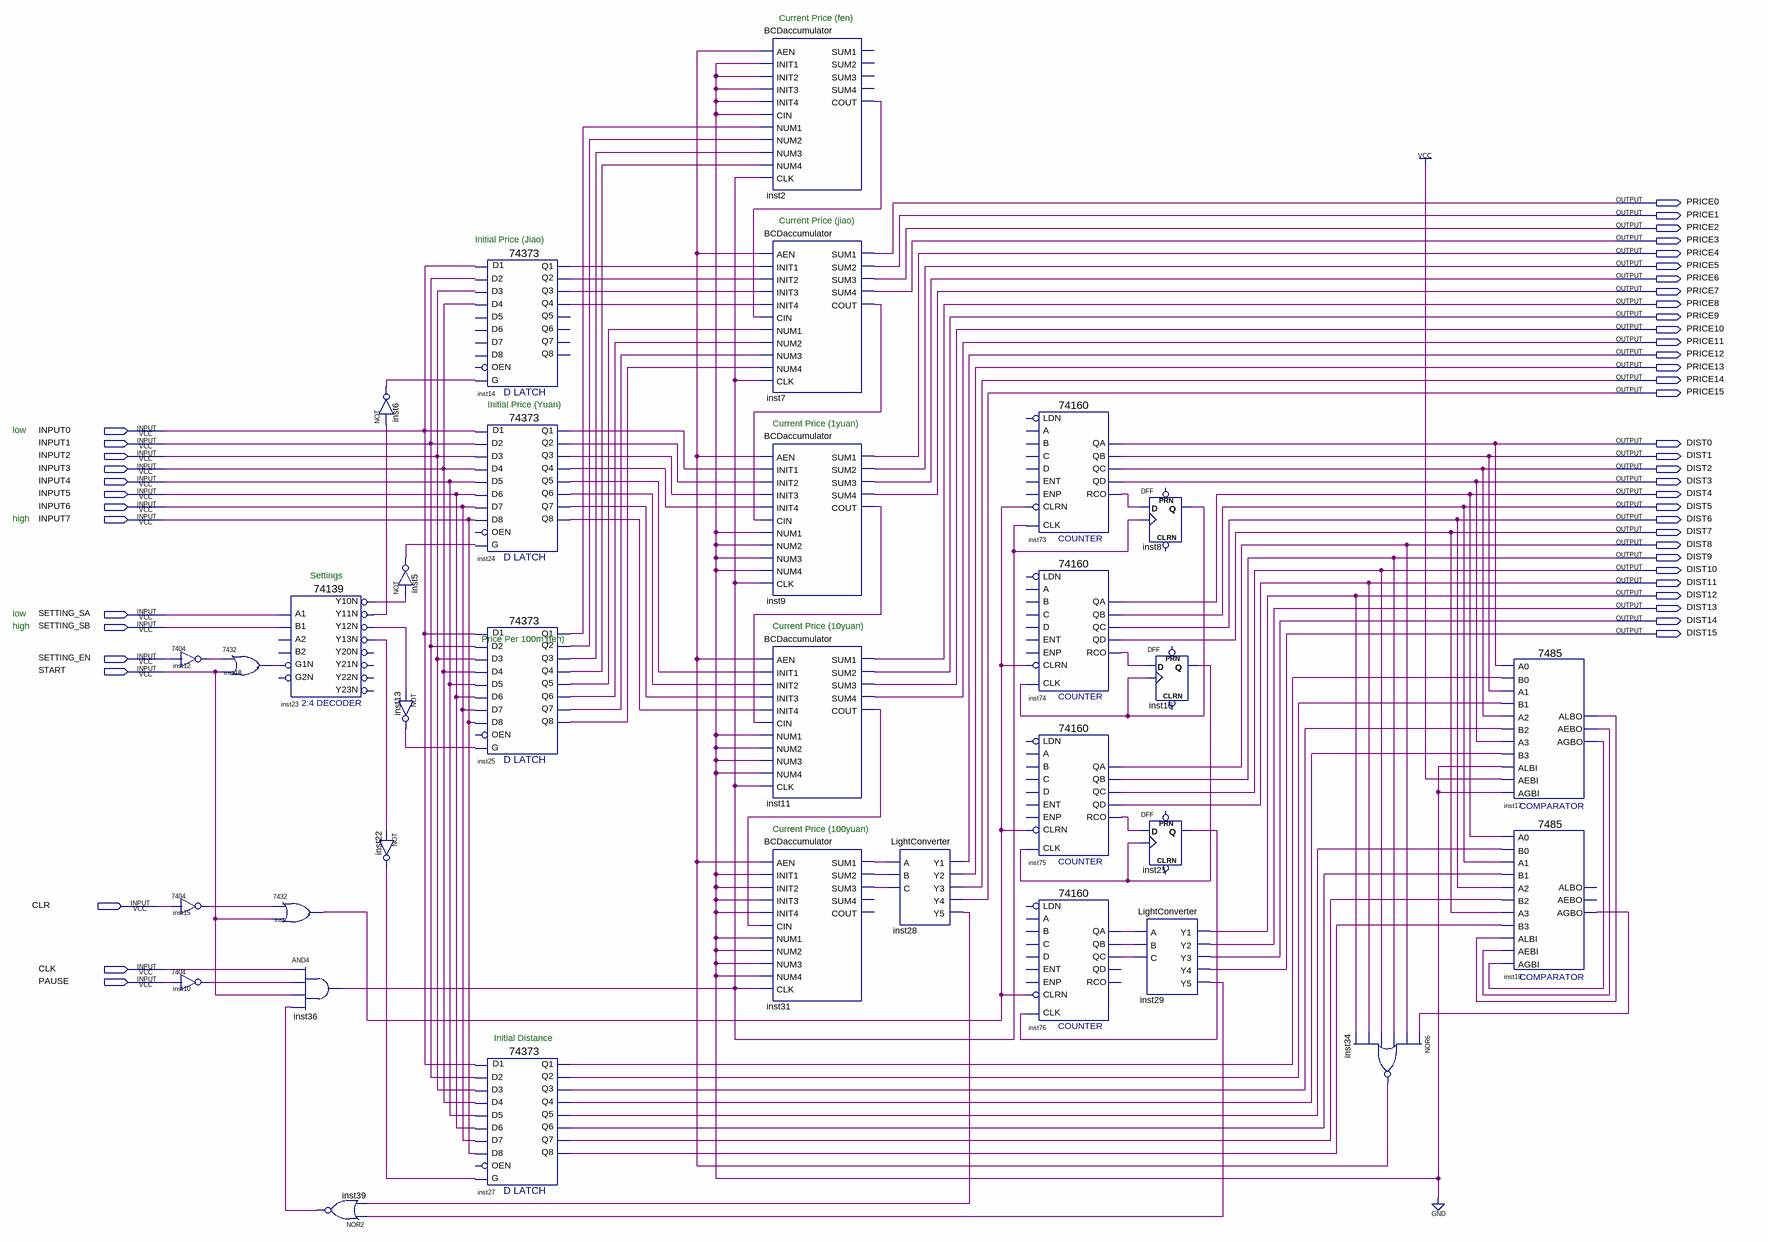
[diagram p0: schematic sheet]
// Quartus schematic taxi.bdf as structural Verilog: 33 symbols, 47 pins
module taxi (
  input  INPUT0,
  input  INPUT1,
  input  INPUT2,
  input  INPUT3,
  input  INPUT4,
  input  INPUT5,
  input  INPUT6,
  input  INPUT7,
  input  SETTING_SA,
  input  SETTING_SB,
  input  SETTING_EN,
  input  START,
  input  CLR,
  input  CLK,
  input  PAUSE,
  output PRICE0,
  output PRICE1,
  output PRICE2,
  output PRICE3,
  output PRICE4,
  output PRICE5,
  output PRICE6,
  output PRICE7,
  output PRICE8,
  output PRICE9,
  output PRICE10,
  output PRICE11,
  output PRICE12,
  output PRICE13,
  output PRICE14,
  output PRICE15,
  output DIST0,
  output DIST1,
  output DIST2,
  output DIST3,
  output DIST4,
  output DIST5,
  output DIST6,
  output DIST7,
  output DIST8,
  output DIST9,
  output DIST10,
  output DIST11,
  output DIST12,
  output DIST13,
  output DIST14,
  output DIST15
);

  wire inst2_cout, inst5_out, inst6_out, inst7_cout, inst8_q, inst9_cout, inst10_1, inst11_cout, inst12_1,
       inst13_out, inst14_q1, inst14_q2, inst14_q3, inst14_q4, inst15_1, inst16_q, inst17_aebo, inst17_agbo,
       inst17_albo, inst18_1, inst19_agbo, inst21_q, inst22_out, inst23_y10n, inst23_y11n, inst23_y12n,
       inst23_y13n, inst24_q1, inst24_q2, inst24_q3, inst24_q4, inst24_q5, inst24_q6, inst24_q7, inst24_q8,
       inst25_q1, inst25_q2, inst25_q3, inst25_q4, inst25_q5, inst25_q6, inst25_q7, inst25_q8, inst27_q1,
       inst27_q2, inst27_q3, inst27_q4, inst27_q5, inst27_q6, inst27_q7, inst27_q8, inst28_y5, inst29_y5,
       inst31_sum1, inst31_sum2, inst31_sum3, inst34_out, inst36_out, inst39_out, inst73_rco, inst74_rco,
       inst75_rco, inst76_qa, inst76_qb, inst76_qc, inst_1;

  \7404  inst12 (.\2 (SETTING_EN), .\1 (inst12_1));
  \7404  inst15 (.\2 (CLR), .\1 (inst15_1));
  \7404  inst10 (.\2 (PAUSE), .\1 (inst10_1));
  \7432  inst18 (.\2 (inst12_1), .\3 (START), .\1 (inst18_1));
  \74139  inst23 (
    .A1(SETTING_SA), .B1(SETTING_SB), .G1N(inst18_1), .Y10N(inst23_y10n), .Y13N(inst23_y13n),
    .Y12N(inst23_y12n), .Y11N(inst23_y11n));  // open: A2, B2, G2N, Y20N, Y21N, Y22N, Y23N
  \7432  inst (.\2 (inst15_1), .\3 (START), .\1 (inst_1));
  and inst36 (inst36_out, CLK, inst10_1, START, inst39_out);
  nor inst39 (inst39_out, inst29_y5, inst28_y5);
  not inst6 (inst6_out, inst23_y11n);
  not inst5 (inst5_out, inst23_y10n);
  not inst13 (inst13_out, inst23_y12n);
  not inst22 (inst22_out, inst23_y13n);
  \74373  inst14 (
    .D1(INPUT0), .D3(INPUT2), .D2(INPUT1), .G(inst6_out), .D4(INPUT3), .Q3(inst14_q3), .Q2(inst14_q2),
    .Q4(inst14_q4), .Q1(inst14_q1));  // open: D6, D7, D5, D8, OEN, Q6, Q7, Q8, Q5
  \74373  inst24 (
    .D1(INPUT0), .D3(INPUT2), .D6(INPUT5), .D7(INPUT6), .D2(INPUT1), .G(inst5_out), .D4(INPUT3), .D5(INPUT4),
    .D8(INPUT7), .Q3(inst24_q3), .Q6(inst24_q6), .Q7(inst24_q7), .Q2(inst24_q2), .Q8(inst24_q8),
    .Q4(inst24_q4), .Q5(inst24_q5), .Q1(inst24_q1));  // open: OEN
  \74373  inst25 (
    .D1(INPUT0), .D3(INPUT2), .D6(INPUT5), .D7(INPUT6), .D2(INPUT1), .G(inst13_out), .D4(INPUT3),
    .D5(INPUT4), .D8(INPUT7), .Q3(inst25_q3), .Q6(inst25_q6), .Q7(inst25_q7), .Q2(inst25_q2), .Q8(inst25_q8),
    .Q4(inst25_q4), .Q5(inst25_q5), .Q1(inst25_q1));  // open: OEN
  \74373  inst27 (
    .D1(INPUT0), .D3(INPUT2), .D6(INPUT5), .D7(INPUT6), .D2(INPUT1), .G(inst22_out), .D4(INPUT3),
    .D5(INPUT4), .D8(INPUT7), .Q3(inst27_q3), .Q6(inst27_q6), .Q7(inst27_q7), .Q2(inst27_q2), .Q8(inst27_q8),
    .Q4(inst27_q4), .Q5(inst27_q5), .Q1(inst27_q1));  // open: OEN
  BCDaccumulator inst2 (
    .AEN(inst34_out), .INIT1(1'b0), .INIT2(1'b0), .INIT3(1'b0), .INIT4(1'b0), .CIN(1'b0), .NUM1(inst25_q1),
    .NUM2(inst25_q2), .NUM3(inst25_q3), .NUM4(inst25_q4), .CLK(inst36_out), .COUT(inst2_cout));  // open: SUM1, SUM2, SUM3, SUM4
  BCDaccumulator inst7 (
    .AEN(inst34_out), .INIT1(inst14_q1), .INIT2(inst14_q2), .INIT3(inst14_q3), .INIT4(inst14_q4),
    .CIN(inst2_cout), .NUM1(inst25_q5), .NUM2(inst25_q6), .NUM3(inst25_q7), .NUM4(inst25_q8),
    .CLK(inst36_out), .SUM1(PRICE0), .SUM2(PRICE1), .SUM3(PRICE2), .SUM4(PRICE3), .COUT(inst7_cout));
  BCDaccumulator inst9 (
    .AEN(inst34_out), .INIT1(inst24_q1), .INIT2(inst24_q2), .INIT3(inst24_q3), .INIT4(inst24_q4),
    .CIN(inst7_cout), .NUM1(1'b0), .NUM2(1'b0), .NUM3(1'b0), .NUM4(1'b0), .CLK(inst36_out), .SUM1(PRICE4),
    .SUM2(PRICE5), .SUM3(PRICE6), .SUM4(PRICE7), .COUT(inst9_cout));
  BCDaccumulator inst11 (
    .AEN(inst34_out), .INIT1(inst24_q5), .INIT2(inst24_q6), .INIT3(inst24_q7), .INIT4(inst24_q8),
    .CIN(inst9_cout), .NUM1(1'b0), .NUM2(1'b0), .NUM3(1'b0), .NUM4(1'b0), .CLK(inst36_out), .SUM1(PRICE8),
    .SUM2(PRICE9), .SUM3(PRICE10), .SUM4(PRICE11), .COUT(inst11_cout));
  BCDaccumulator inst31 (
    .AEN(inst34_out), .INIT1(1'b0), .INIT2(1'b0), .INIT3(1'b0), .INIT4(1'b0), .CIN(inst11_cout), .NUM1(1'b0),
    .NUM2(1'b0), .NUM3(1'b0), .NUM4(1'b0), .CLK(inst36_out), .SUM1(inst31_sum1), .SUM2(inst31_sum2),
    .SUM3(inst31_sum3));  // open: SUM4, COUT
  LightConverter inst28 (
    .A(inst31_sum1), .B(inst31_sum2), .C(inst31_sum3), .Y1(PRICE12), .Y2(PRICE13), .Y3(PRICE14),
    .Y4(PRICE15), .Y5(inst28_y5));
  \74160  inst73 (
    .CLK(inst36_out), .CLRN(inst_1), .QD(DIST3), .QA(DIST0), .QB(DIST1), .QC(DIST2), .RCO(inst73_rco));  // open: ENT, A, B, C, D, LDN, ENP
  \74160  inst74 (
    .CLK(inst8_q), .CLRN(inst_1), .QD(DIST7), .QA(DIST4), .QB(DIST5), .QC(DIST6), .RCO(inst74_rco));  // open: ENT, A, B, C, D, LDN, ENP
  \74160  inst75 (
    .CLK(inst16_q), .CLRN(inst_1), .QD(DIST11), .QA(DIST8), .QB(DIST9), .QC(DIST10), .RCO(inst75_rco));  // open: ENT, A, B, C, D, LDN, ENP
  \74160  inst76 (
    .CLK(inst21_q), .CLRN(inst_1), .QA(inst76_qa), .QB(inst76_qb), .QC(inst76_qc));  // open: ENT, A, B, C, D, LDN, ENP, QD, RCO
  DFF inst8 (.CLK(inst36_out), .D(inst73_rco), .Q(inst8_q));  // open: CLRN, PRN
  DFF inst16 (.CLK(inst8_q), .D(inst74_rco), .Q(inst16_q));  // open: CLRN, PRN
  DFF inst21 (.CLK(inst16_q), .D(inst75_rco), .Q(inst21_q));  // open: CLRN, PRN
  LightConverter inst29 (
    .A(inst76_qa), .B(inst76_qb), .C(inst76_qc), .Y1(DIST12), .Y2(DIST13), .Y3(DIST14), .Y4(DIST15),
    .Y5(inst29_y5));
  nor inst34 (inst34_out, inst19_agbo, DIST8, DIST9, DIST10, DIST11, DIST12);
  \7485  inst17 (
    .A3(DIST3), .B2(inst27_q3), .A2(DIST2), .AEBI(1'b1), .AGBI(1'b0), .ALBI(1'b0), .A0(DIST0),
    .B0(inst27_q1), .B3(inst27_q4), .A1(DIST1), .B1(inst27_q2), .ALBO(inst17_albo), .AGBO(inst17_agbo),
    .AEBO(inst17_aebo));
  \7485  inst19 (
    .A3(DIST7), .B2(inst27_q7), .A2(DIST6), .AEBI(inst17_aebo), .AGBI(inst17_agbo), .ALBI(inst17_albo),
    .A0(DIST4), .B0(inst27_q5), .B3(inst27_q8), .A1(DIST5), .B1(inst27_q6), .AGBO(inst19_agbo));  // open: ALBO, AEBO

  // Notes on the sheet:
  //   Current Price (fen)
  //   Current Price (jiao)
  //   Initial Price (Jiao)
  //   Initial Price (Yuan)
  //   Current Price (1yuan)
  //   low
  //   high
  //   Settings
  //   low
  //   high
  //   Current Price (10yuan)
  //   Price Per 100m (fen)
  //   Current Price (100yuan)
  //   Initial Distance
endmodule
